# EAGLE design cc2652rb_v3.1 (EAGLE 9.6.2)
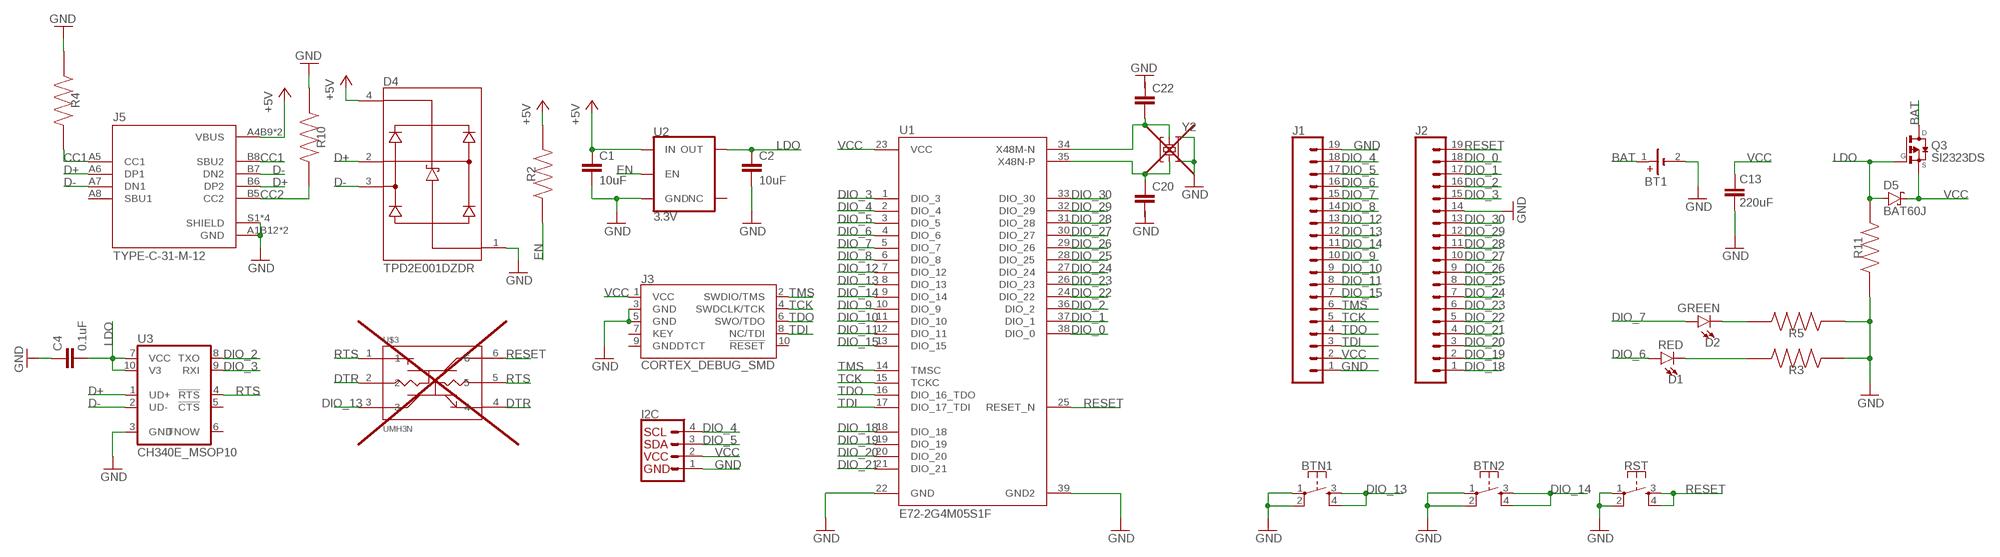
[diagram p0: schematic, sheet 1]

## Parts
BT1  79527141  [79527141]
BTN1  MOMENTARY-SWITCH-SPST-2-SMD-4.6X2.8MM  [TACTILE_SWITCH_SMD_4.6X2.8MM]
BTN2  MOMENTARY-SWITCH-SPST-2-SMD-4.6X2.8MM  [TACTILE_SWITCH_SMD_4.6X2.8MM]
C1  10uF  10UF-0603-6.3V-20%  [0603]
C2  10uF  10UF-0603-6.3V-20%  [0603]
C4  0.1uF  0.1UF-0603-25V-(+80/-20%)  [0603]
C13  220uF  C_TANTALUM-2917(7343-METRIC)  [CAPM7343X310]
C20  7p  CAP0402  [CAPC1005X40N]
C22  7p  CAP0402  [CAPC1005X40N]
D1  RED  LED-RED0603  [LED-0603]
D2  GREEN  LED-GREEN0603  [LED-0603]
D4  TPD2E001DZDR  [SOT192P237X122-4N]
D5  BAT60J  [SOD323_ST]
I2C  QWIIC_CONNECTORJS-1MM  [1X04_1MM_RA]
J1  CONN_191X19_NO_SILK  [1X19_NO_SILK]
J2  CONN_191X19_NO_SILK  [1X19_NO_SILK]
J3  CORTEX_DEBUG_SMD  [SAMTECH_FTSH-105-01]
J5  TYPE-C-31-M-12  [HRO_TYPE-C-31-M-12]
Q3  SI2323DS  [SOT23]
R2  10k  RC0402FR-073M6L  [RESC1005X40N]
R3  2k  RC0402FR-073M6L  [RESC1005X40N]
R4  5.1k  RC0402FR-073M6L  [RESC1005X40N]
R5  2k  RC0402FR-073M6L  [RESC1005X40N]
R10  5.1k  RC0402FR-073M6L  [RESC1005X40N]
R11  100k  RC0402FR-073M6L  [RESC1005X40N]
RST  MOMENTARY-SWITCH-SPST-2-SMD-4.6X2.8MM  [TACTILE_SWITCH_SMD_4.6X2.8MM]
U1  E72-2G4M05S1F  [E72-2G4M05S1F]
U2  3.3V  V_REG_AP2112K-3.3V  [SOT23-5]
U3  CH340E_MSOP10  [MSOP10]
U$3  UMH3N  [SOP65P210X100-6N]
Y2  Q22FA12800150  48.000MHZ_CX2016DB48000C0FPLC1  [XTAL-4P-2016]

## Nets
+5V: C1.1 D4.4(VCC) J5.A4B9(VBUS) J5.B4A9(VBUS) R2.2 U2.1(IN)
BAT: BT1.1(+) Q3.3(D)
CC1: J5.A5(CC1) J5.B8(SBU2) R4.2
CC2: J5.B5(CC2) R10.2
D+: D4.2(IO1) J5.A6(DP1) J5.B6(DP2) U3.1(UD+)
D-: D4.3(IO2) J5.A7(DN1) J5.B7(DN2) U3.2(UD-)
DIO_0: J2.18 U1.38(DIO_0)
DIO_1: J2.17 U1.37(DIO_1)
DIO_2: J2.16 U1.36(DIO_2) U3.8(TXO)
DIO_3: J2.15 U1.1(DIO_3) U3.9(RXI)
DIO_4: I2C.4(SCL) J1.18 U1.2(DIO_4)
DIO_5: I2C.3(SDA) J1.17 U1.3(DIO_5)
DIO_6: D1.A J1.16 U1.4(DIO_6)
DIO_7: D2.A J1.15 U1.5(DIO_7)
DIO_8: J1.14 U1.6(DIO_8)
DIO_9: J1.10 U1.10(DIO_9)
DIO_10: J1.9 U1.11(DIO_10)
DIO_11: J1.8 U1.12(DIO_11)
DIO_12: J1.13 U1.7(DIO_12)
DIO_13: BTN1.3 BTN1.4 J1.12 U1.8(DIO_13) U$3.3
DIO_14: BTN2.3 BTN2.4 J1.11 U1.9(DIO_14)
DIO_15: J1.7 U1.13(DIO_15)
DIO_18: J2.1 U1.18(DIO_18)
DIO_19: J2.2 U1.19(DIO_19)
DIO_20: J2.3 U1.20(DIO_20)
DIO_21: J2.4 U1.21(DIO_21)
DIO_22: J2.5 U1.24(DIO_22)
DIO_23: J2.6 U1.26(DIO_23)
DIO_24: J2.7 U1.27(DIO_24)
DIO_25: J2.8 U1.28(DIO_25)
DIO_26: J2.9 U1.29(DIO_26)
DIO_27: J2.10 U1.30(DIO_27)
DIO_28: J2.11 U1.31(DIO_28)
DIO_29: J2.12 U1.32(DIO_29)
DIO_30: J2.13 U1.33(DIO_30)
DTR: U$3.2 U$3.4
EN: R2.1 U2.3(EN)
GND: BT1.2(-) BTN1.1 BTN1.2 BTN2.1 BTN2.2 C1.2 C2.2 C4.1 C13.2 D4.1(GND) I2C.1(GND) J1.1 J1.19 J2.14 J3.3(GND) J3.5(GND) J5.A1B12(GND) J5.B1A12(GND) J5.S1(SHIELD) J5.S2(SHIELD) J5.S3(SHIELD) J5.S4(SHIELD) R3.1 R4.1 R5.1 R10.1 R11.1 RST.1 RST.2 U1.22(GND) U1.39(GND2) U2.2(GND) U3.3(GND) Y2.2 Y2.4
LDO: C2.1 C4.2 D5.A Q3.1(G) R11.2 U2.5(OUT) U3.7(VCC) U3.10(V3)
N$1: C20.1 U1.35(X48N-P) Y2.1
N$2: D1.C R3.2
N$3: D2.C R5.2
N$4: C22.2 U1.34(X48M-N) Y2.3
RESET: J2.19 RST.3 RST.4 U1.25(RESET_N) U$3.6
RTS: U3.4(!RTS) U$3.1 U$3.5
TCK: J1.5 J3.4(SWDCLK/TCK) U1.15(TCKC)
TDI: J1.3 J3.8(NC/TDI) U1.17(DIO_17_TDI)
TDO: J1.4 J3.6(SWO/TDO) U1.16(DIO_16_TDO)
TMS: J1.6 J3.2(SWDIO/TMS) U1.14(TMSC)
VCC: C13.1 D5.C I2C.2(VCC) J1.2 J3.1(VCC) Q3.2(S) U1.23(VCC)
Unconnected: C20.2 C22.1 J3.7(KEY) J3.9(GNDDTCT) J3.10(!RESET) J5.A8(SBU1) U2.4(NC) U3.5(!CTS) U3.6(TNOW)

## Library data of the parts
BT1 = Battery Holder_2:79527141: BATTERY HOLDER COIN 20MM SMD Manufacturer's datasheet <https://katalog.we-online.de/em/datasheet/79527141.pdf>; CREATED_BY: PCBLayout.com; DIGIKEY_PART_NO: 732-12325-2-ND; MANUFACTURER: Wurth Electronics Inc.; MPN: 79527141
BTN1 BTN2 RST = SparkFun-Switches:MOMENTARY-SWITCH-SPST-2: Momentary Switch (Pushbutton) - SPST - Two Circuits Normally-open (NO) SPST momentary switches (buttons, pushbuttons). Schematic symbol includes two switch circuits. Variants SMD-4.6MMX2.8MM - 4.60mm x 2.80mm Tactile Momentary Button Switch - Used on SparkFun SAMD21 Mini Breakout <https://www.sparkfun.com/products/13664> SMD-5.2MM - Mini Pushbutton Switch - SMD <https://www.sparkfun.com/products/8720> - Used on Arduino Pro Mini <https://www.sparkfun.com/products/11114>; PROD_ID: SWCH-13065
C1 C2 = SparkFun-Capacitors:10UF: 10.0µF ceramic capacitors A capacitor is a passive two-terminal electrical component used to store electrical energy temporarily in an electric field.; PROD_ID: CAP-11015
C4 = SparkFun-Capacitors:0.1UF: 0.1µF ceramic capacitors A capacitor is a passive two-terminal electrical component used to store electrical energy temporarily in an electric field.; PROD_ID: CAP-00810
C13 = Capacitor:C: Capacitor - Generic; CATEGORY: Capacitor
C20 C22 = discretes-dev:CAP0402: CAP, 0402; AVAILABILITY: Good; DESCRIPTION: RESISTOR, 0402 0.063W 1% 3M6; Resistance:3.6Mohm; Resistance Tolerance:± 1%; Power Rating:0.063W; Voltage Rating:50V; Series:RC32H; Temperature Coefficient:± 100ppm/°C; Resistor Element Type:Thick Film; Resistor Case Style:0402; No. of Pins:2; SVHC:No SVHC; Case Style:0402; External Length / Height:1mm; Temperature Coeff. +:100ppm/°C; Temperature Coeff. -:100ppm/°C; External Depth:0.35mm; External Width:0.5mm; Operating Temperature Range:-55°C to +155°C; Overload Voltage:100V; MF: Yageo; MP: RC0402FR-073M6L; PACKAGE: 1005 Panasonic Electronic Components; PRICE: None; PURCHASE-URL: https://pricing.snapeda.com/search/part/RC0402FR-073M6L/?ref=eda
D1 = SparkFun-LED:LED-RED: Red SMD LED Used in manufacturing of most products at SparkFun Packages: 0603 - SMD 0603 package [Product Link] <http://docs.avagotech.com/docs/AV02-0551EN> 0603 SMART - SMD 0603 SMART package ( more efficient and expensive)[Product Link] <http://www.osram-os.com/Graphics/XPic2/00077099_0.pdf> 1206 - SMD1206 package [Product Link] <https://www.sparkfun.com/datasheets/DevTools/LilyPad/Q150OVS4.pdff> SparkFun Products: Pro Mini 328 -5V <https://www.sparkfun.com/products/821> RedBoard <https://www.sparkfun.com/products/12757> IOIO-OTG <https://www.sparkfun.com/products/13613>; PROD_ID: DIO-00819
D2 = SparkFun-LED:LED-GREEN: Green SMD LED Used in manufacturing of various products at SparkFun Packages: 0603 - SMD 0603 package [Product Link] <http://www.futureelectronics.com/en/technologies/semiconductors/optoelectronics/leds/Pages/9894312-LTST-C190GKT.aspx?CrossPart=HSMG-C190&IM=0> LilyPad 1206 - SMD1206 LilyPad package [Product Link] <http://www.futureelectronics.com/en/Technologies/Product.aspx?ProductID=IN150NGHARVATEKCORPORATION2049943&IM=0> 1206 - SMD1206 package [Product Link] <http://www.futureelectronics.com/en/technologies/semiconductors/optoelectronics/leds/Pages/8315665-LTST-C150KGKT.aspx?IM=0> 1206 Bottom Mount -SMD 1206 Bottom Mount [Product Link] <http://www.digikey.com/product-detail/en/lite-on-inc/LTST-C230KGKT/160-1456-1-ND/386854> SparkFun Products: Pro Mini 328 -5V <https://www.sparkfun.com/products/821> RedBoard <https://www.sparkfun.com/products/12757> MP3 Trigger <https://www.sparkfun.com/products/13720> Makey Makey <https://www.sparkfun.com/products/11076>; PROD_ID: DIO-00821
D4 = TPD2E001DZDR:TPD2E001DZDR: Low-capacitance 2-channel +/-15k-V ESD protection array for high-speed data interfaces Check prices <https://pricing.snapeda.com/parts/TPD2E001DZDR/Texas%20Instruments/view-part?ref=eda>; AVAILABILITY: In Stock; DESCRIPTION: Low-capacitance 2-channel +/-15k-V ESD protection array for high-speed data interfaces 4-SOT-23 -40 to 85; MF: Texas Instruments; MP: TPD2E001DZDR; PACKAGE: SOT-23-4 Texas Instruments; PRICE: None; PURCHASE-URL: https://pricing.snapeda.com/search/part/TPD2E001DZDR/?ref=eda
D5 = diode:BAT60J: Schottky barrier diode Source: www.st.com, BAT60J.pdf
I2C = SparkFun-Connectors:QWIIC_CONNECTOR: SparkFun I2C Standard Qwiic Connector An SMD 1mm pitch JST connector makes it easy and quick (get it? Qwiic?) to connect I2C devices to each other. The Qwiic system <http://www.sparkfun.com/qwiic> enables fast and solderless connection between popular platforms and various sensors and actuators. We carry 200mm <https://www.sparkfun.com/products/14204>, 100mm <https://www.sparkfun.com/products/14205>, 50mm <https://www.sparkfun.com/products/14206>, and breadboard friendly <https://www.sparkfun.com/products/14207> Qwiic cables. We also offer 10 pcs strips <https://www.sparkfun.com/products/14323> the SMD connectors.
J1 J2 = SparkFun-Connectors:CONN_19: Multi connection point. Often used as Generic Header-pin footprint for 0.1 inch spaced/style header connections On any of the 0.1 inch spaced packages, you can populate with these: Break Away Headers - Straight <https://www.sparkfun.com/products/116> (PRT-00116) Break Away Male Headers - Right Angle <https://www.sparkfun.com/products/553> (PRT-00553) Female Headers <https://www.sparkfun.com/products/115> (PRT-00115) Break Away Headers - Machine Pin <https://www.sparkfun.com/products/117> (PRT-00117) Break Away Female Headers - Swiss Machine Pin <https://www.sparkfun.com/products/743> (PRT-00743) For SCREWTERMINALS and SPRING TERMINALS visit here: Screw Terimnals on SparkFun.com <https://www.sparkfun.com/search/results?term=Screw+Terminals> (5mm/3.5mm/2.54mm spacing) This device is also useful as a general connection point to wire up your design to another part of your project. Our various solder wires solder well into these plated through hole pads. Hook-Up Wire - Assortment (Stranded, 22 AWG) <https://www.sparkfun.com/products/11375> (PRT-11375) Hook-Up Wire - Assortment (Solid Core, 22 AWG) <https://www.sparkfun.com/products/11367> (PRT-11367) View the entire wire category on our website here <https://www.sparkfun.com/categories/141> Special notes: Molex polarized connector foot print use with SKU : PRT-08231 with associated crimp pins and housings. 1MM SMD Version SKU: PRT-10208 NOTES ON THE VARIANTS LOCK and LOCK_LONGPADS... This footprint was designed to help hold the alignment of a through-hole component (i.e. 6-pin header) while soldering it into place. You may notice that each hole has been shifted either up or down by 0.005 of an inch from it's more standard position (which is a perfectly straight line). This slight alteration caused the pins (the squares in the middle) to touch the edges of the holes. Because they are alternating, it causes a "brace" to hold the component in place. 0.005 has proven to be the perfect amount of "off-center" position when using our standard breakaway headers. Although looks a little odd when you look at the bare footprint, once you have a header in there, the alteration is very hard to notice. Also,if you push a header all the way into place, it is covered up entirely on the bottom side.
J3 = SparkFun-Connectors:CORTEX_DEBUG: Cortex Debug Connector - 10 pin Supports JTAG debug, Serial Wire debug, and Serial Wire Viewer. PTH and SMD connector options available. General Connector Information <http://infocenter.arm.com/help/topic/com.arm.doc.faqs/attached/13634/cortex_debug_connectors.pdf> Products: PTH Connector <http://www.digikey.com/product-detail/en/cnc-tech/3220-10-0100-00/1175-1627-ND/3883661> -via Digi-Key SparkFun PSoc <https://www.sparkfun.com/products/13229> SparkFun T <https://www.sparkfun.com/products/13810>
J5 = TYPE-C-31-M-12:TYPE-C-31-M-12: USB Connectors 24 Receptacle 1 8.94*7.3mm RoHS; AVAILABILITY: Unavailable; DESCRIPTION: USB Connectors 24 Receptacle 1 8.94*7.3mm RoHS; MF: HRO Electronics Co., Ltd.; MP: TYPE-C-31-M-12; PACKAGE: Package; PRICE: None
Q3 = SI2323DS:SI2323DS: P-Channel MOSFET; AVAILABILITY: Unavailable; DESCRIPTION: P-Channel 20V 3.7A (Ta) 750mW (Ta) Surface Mount SOT-23-3 (TO-236); MF: Vishay Siliconix; MP: SI2323DS; PACKAGE: SOT-23-3 Vishay Siliconix; PRICE: None
R2-R5 R10 R11 = RC0402FR-073M6L:RC0402FR-073M6L: RESISTOR, 0402 0.063W 1% 3M6; Resistance:3.6Mohm; Resistance Tolerance:± 1%; Power Rating:0.063W; Voltage Rating:50V; Series:RC32H; Temperature Coefficient:± 100ppm/°C; Resistor Element Type:Thick Film; Resistor Case Style:0402; No. of Pins:2; SVHC:No SVHC; Case Style:0402; External Length / Height:1mm; Temperature Coeff. +:100ppm/°C; Temperature Coeff. -:100ppm/°C; External Depth:0.35mm; External Width:0.5mm; Operating Temperature Range:-55°C to +155°C; Overload Voltage:100V Check prices <https://pricing.snapeda.com/parts/RC0402FR-073M6L/Yageo/view-part?ref=eda>; AVAILABILITY: Good; DESCRIPTION: RESISTOR, 0402 0.063W 1% 3M6; Resistance:3.6Mohm; Resistance Tolerance:± 1%; Power Rating:0.063W; Voltage Rating:50V; Series:RC32H; Temperature Coefficient:± 100ppm/°C; Resistor Element Type:Thick Film; Resistor Case Style:0402; No. of Pins:2; SVHC:No SVHC; Case Style:0402; External Length / Height:1mm; Temperature Coeff. +:100ppm/°C; Temperature Coeff. -:100ppm/°C; External Depth:0.35mm; External Width:0.5mm; Operating Temperature Range:-55°C to +155°C; Overload Voltage:100V; MF: Yageo; MP: RC0402FR-073M6L; PACKAGE: 1005 Panasonic Electronic Components; PRICE: None; PURCHASE-URL: https://pricing.snapeda.com/search/part/RC0402FR-073M6L/?ref=eda
U1 = E72-2G4M05S1F:E72-2G4M05S1F
U2 = SparkFun-IC-Power:V_REG_AP2112: AP2112 - 600mA CMOS LDO Regulator w/ Enable The AP2112 is CMOS process low dropout linear regulator with enable function, the regulator delivers a guaranteed 600mA (min.) continuous load current. Features Output Voltage Accuracy: ±1.5% Output Current: 600mA (Min.) Foldback Short Current Protection: 50mA Enable Function to Turn ON/OFF VOUT Low Dropout Voltage (3.3V): 250mV (Typ.) @IOUT=600mA Excellent Load Regulation: 0.2%/A (Typ.) Excellent Line Regulation: 0.02%/V (Typ.) Low Quiescent Current: 55μA (Typ.) Low Standby Current: 0.01μA (Typ.) Low Output Noise: 50μVRMS PSRR: 100Hz -65dB, 1kHz -65dB OTSD Protection Stable with 1.0μF Flexible Cap: Ceramic, Tantalum and Aluminum Electrolytic Operation Temperature Range: -40°C to 85°C ESD: MM 400V, HBM 4000V; PROD_ID: VREG-12457
U3 = CH340E:CH340E: Check prices <https://pricing.snapeda.com/parts/CH340E/WCH/view-part?ref=eda>; AVAILABILITY: Not in stock; DESCRIPTION: USB to serial chip CH340; MF: WCH; MP: CH340E; PACKAGE: Package; PRICE: None
U$3 = UMH3N:UMH3N: Dual PNP/NPN transistor for chip reset; AVAILABILITY: Unavailable; DESCRIPTION: Pre-Biased Bipolar Transistor (BJT) 2 NPN - Pre-Biased (Dual) 50V 100mA 250MHz 150mW Surface Mount UMT6; MF: Rohm; MP: UMH3N; PACKAGE: SOT-363 Rohm; PRICE: None
Y2 = ok-xtal-osc-dev:48.000MHZ_CX2016DB48000C0FPLC1: 48MHz ±10ppm Crystal 7pF 50 Ohms 4-SMD, No Lead Datasheet <https://media.digikey.com/pdf/Data%20Sheets/Kyocera%20International/CX2016DB48000C0FPLC1_DS.pdf>; DIGIKEY_PART: 1253-2042-1-ND; MFG_NAME: KYOCERA; MFG_PART: CX2016DB48000C0FPLC1

## Net classes
0 default: clearance 0.205 mm

## Board
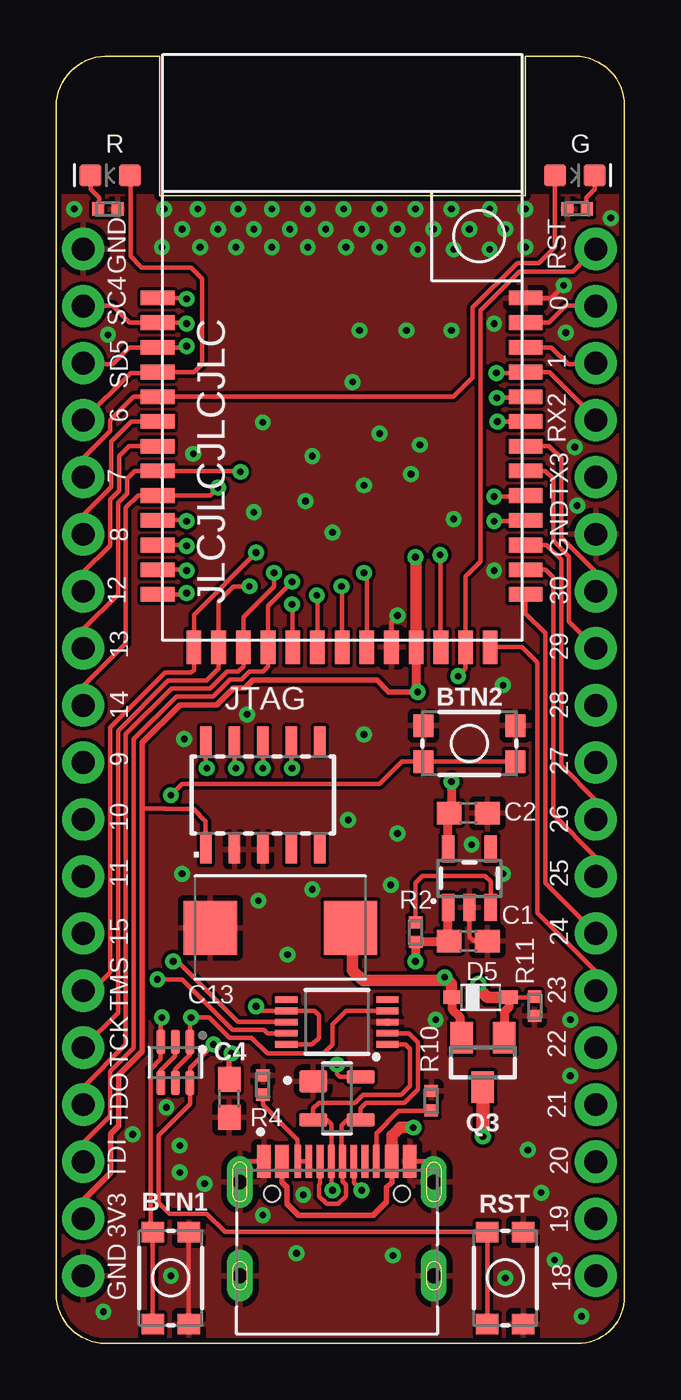
[diagram p1: board, top side]
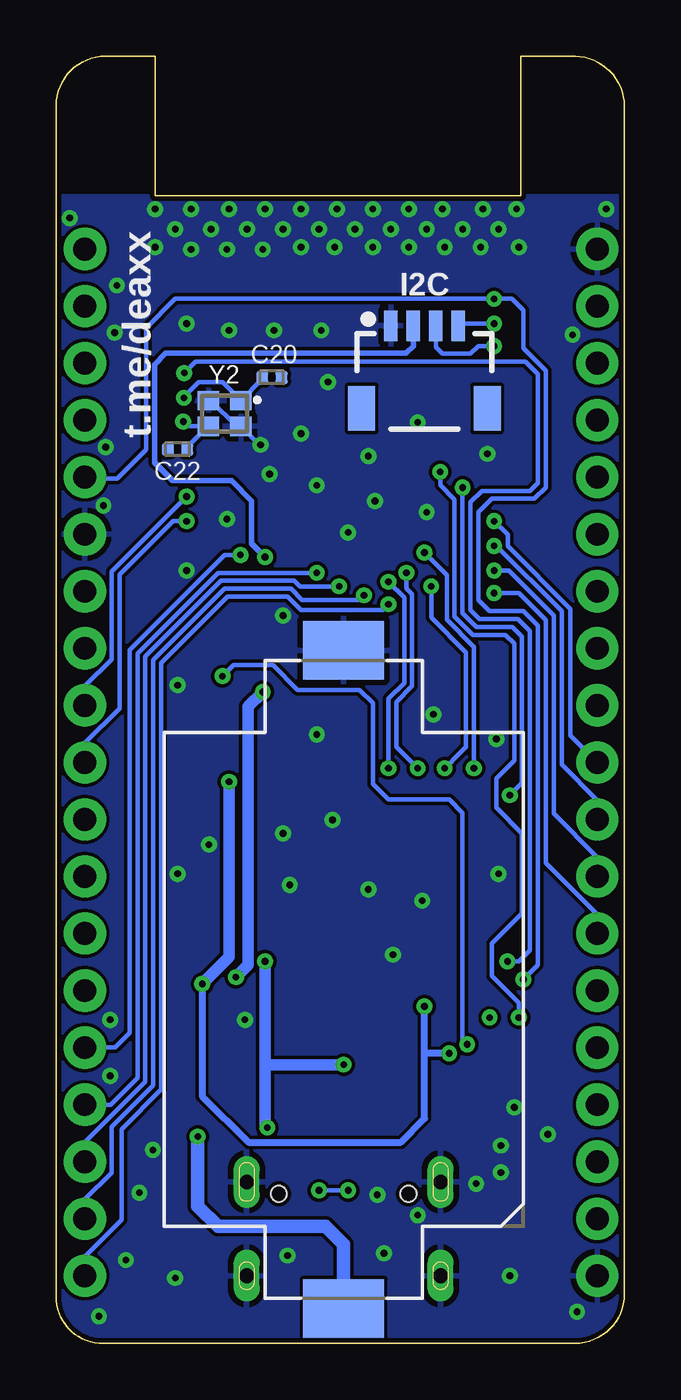
[diagram p2: board, bottom side, seen from below]

Size 25.32 x 57.32 mm. Coordinates in mm from the lower left corner, seen from the top.
Outline: 2.31,0.01 2.41,0.01
Outline: 2.41,0.01 23.21,0.01 arc87 25.31,1.91 25.31,54.91
Outline: 2.31,57.31 2.41,57.31
Outline: 2.41,57.31 arc87 0.01,55.31 0.01,2.41 arc100 2.41,0.01
Outline: 2.41,57.31 4.61,57.31 4.61,51.11 20.91,51.11 20.91,57.31 22.91,57.31
Outline: 22.91,57.31 23.01,57.31
Outline: 25.31,55.01 25.31,54.91
Outline: 22.91,57.31 arc-100 25.31,54.91
Copper layers (1*16): Top 0.035mm / dielectric 1.5mm / Bottom 0.035mm
Design rules "default *": minimum track width 0.2mm, minimum drill 0.3mm, track to track 6mil, track to pad 6mil, pad to pad 6mil, via to via 6mil, smd to smd 6mil, copper to edge 0.2mm, drill to drill 0.3mm, minimum pad ring 10mil, minimum via ring 8mil, stop-mask expansion 2.5mil, vias tented up to drill 0.3mm, thermal gap 10mil

### Footprints (pad centres in the part's own frame; a part is rotated, then mirrored left to right if it is on the bottom)
79527141 = smd 2.6 x 3.6: 1 -14.65,0; 2 14.65,0
TACTILE_SWITCH_SMD_4.6X2.8MM = smd 0.9 x 1: 1 -2.05,-0.8; 2 2.05,-0.8; 3 2.05,0.8; 4 -2.05,0.8
0603 = smd 1.1 x 1: 1 -0.85,0; 2 0.85,0
CAPM7343X310 = smd 2.368 x 2.404: 1 -3.121,0; 2 3.121,0
CAPC1005X40N = smd 0.54 x 0.6: 1 -0.432,0; 2 0.432,0
LED-0603 = smd 1 x 1: A -0.877,0; C 0.877,0
SOT192P237X122-4N = smd 1.24 x 0.99: 1 -1.055,0.76 | smd 1.24 x 0.59: 2 -1.055,-0.96; 3 1.055,-0.96; 4 1.055,0.96
SOD323_ST = smd 0.8 x 0.6: A 1.25,0; C -1.25,0
1X04_1MM_RA = smd 0.6 x 1.35: 1 -1.5,0; 2 -0.5,0; 3 0.5,0; 4 1.5,0 | smd 1.2 x 2: NC1 2.8,-3.675; NC2 -2.8,-3.675
1X19_NO_SILK = drill 1.016 pad 1.88: 1 0,0; 2 2.54,0; 3 5.08,0; 4 7.62,0; 5 10.16,0; 6 12.7,0; 7 15.24,0; 8 17.78,0; 9 20.32,0; 10 22.86,0; 11 25.4,0; 12 27.94,0; 13 30.48,0; 14 33.02,0; 15 35.56,0; 16 38.1,0; 17 40.64,0; 18 43.18,0; 19 45.72,0
SAMTECH_FTSH-105-01 = smd 0.508 x 1.27: 1 -2.54,-2.413; 2 -2.54,2.413; 3 -1.27,-2.413; 4 -1.27,2.413; 5 0,-2.413; 6 0,2.413; 7 1.27,-2.413; 8 1.27,2.413; 9 2.54,-2.413; 10 2.54,2.413
HRO_TYPE-C-31-M-12 = smd 0.6 x 1.45: A1B12 -3.25,5.095; A4B9 -2.45,5.095; B1A12 3.25,5.095; B4A9 2.45,5.095 | smd 0.3 x 1.45: A5 -1.25,5.095; A6 -0.25,5.095; A7 0.25,5.095; A8 1.25,5.095; B5 1.75,5.095; B6 0.75,5.095; B7 -0.75,5.095; B8 -1.75,5.095 | drill 0.65 pad 1.05 long: S1 -4.32,4.18; S2 4.32,4.18; S3 -4.32,0; S4 4.32,0 | hole 0.7: -2.89,3.65; 2.89,3.65
SOT23 = smd 1 x 1.4: 1 -0.95,-1.1; 2 0.95,-1.1; 3 0,1.1
RESC1005X40N = smd 0.54 x 0.6: 1 -0.432,0; 2 0.432,0
E72-2G4M05S1F = smd 1.5 x 0.65: 1 -8.43,3.15; 2 -8.43,2.05; 3 -8.43,0.95; 4 -8.43,-0.15; 5 -8.43,-1.25; 6 -8.43,-2.35; 7 -8.43,-3.45; 8 -8.43,-4.55; 9 -8.43,-5.65; 10 -8.43,-6.75; 11 -8.43,-7.85; 12 -8.43,-8.95; 13 -8.43,-10.05; 27 7.96,-10.05; 28 7.96,-8.95; 29 7.96,-7.85; 30 7.96,-6.75; 31 7.96,-5.65; 32 7.96,-4.55; 33 7.96,-3.45; 34 7.96,-2.35; 35 7.96,-1.25; 36 7.96,-0.15; 37 7.96,0.95; 38 7.96,2.05; 39 7.96,3.15 | smd 0.65 x 1.5: 14 -6.81,-12.4; 15 -5.71,-12.4; 16 -4.61,-12.4; 17 -3.51,-12.4; 18 -2.41,-12.4; 19 -1.31,-12.4; 20 -0.21,-12.4; 21 0.89,-12.4; 22 1.99,-12.4; 23 3.09,-12.4; 24 4.19,-12.4; 25 5.29,-12.4; 26 6.39,-12.4
SOT23-5 = smd 0.55 x 1.2: 1 -0.95,-1.3; 2 0,-1.3; 3 0.95,-1.3; 4 0.95,1.3; 5 -0.95,1.3
MSOP10 = smd 1 x 0.3: 1 -2.25,1; 2 -2.25,0.5; 3 -2.25,0; 4 -2.25,-0.5; 5 -2.25,-1; 6 2.25,-1; 7 2.25,-0.5; 8 2.25,0; 9 2.25,0.5; 10 2.25,1
SOP65P210X100-6N = smd 1.09 x 0.4: 1 -0.92,0.65; 2 -0.92,0; 3 -0.92,-0.65; 4 0.92,-0.65; 5 0.92,0; 6 0.92,0.65
XTAL-4P-2016 = smd 0.95 x 0.85: 1 -0.725,-0.575; 2 0.725,-0.575; 3 0.725,0.575; 4 -0.725,0.575

### Placement (x,y rotation side)
BT1  12.51,16.21 90 bottom
BTN1  5.11,2.91 90 top
BTN2  18.41,26.71 180 top
C1  18.36,17.91 0 top
C2  18.36,23.61 0 top
C4  7.71,10.91 90 top
C13  9.99,18.51 180 top
C20  15.71,43.01 0 bottom
C22  19.91,39.81 0 bottom
D1  2.41,52.01 180 top
D2  23.11,52.01 0 top
D4  12.51,10.91 0 top
D5  18.91,15.41 0 top
I2C  8.91,45.31 0 bottom
J1  1.21,3.01 90 top
J2  24.04,3.01 90 top
J3  9.21,24.41 0 top
J5  12.51,3.01 0 top
Q3  19.01,12.51 180 top
R2  16.01,18.31 270 top
R3  2.31,50.51 180 top
R4  9.21,11.51 270 top
R5  23.21,50.51 0 top
R10  16.71,10.81 270 top
R11  21.31,15.01 90 top
RST  20.01,2.91 90 top
U1  12.95,43.4 0 top
U2  18.41,20.71 0 top
U3  12.51,14.31 180 top
U$3  5.31,12.51 270 top
Y2  17.81,41.41 180 bottom

### Tracks (layer width: path | path; a pad name or v marks a point on that pad's centre or on a via)
+5V  (via drill 0.3)
  Top 0.2: D4.4 12.65,11.87 12.51,12.01 v12.51,12.41
  Top 0.254: J5.A4B9 10.06,7.18 10.3,6.94 10.3,6.22 10.81,5.71 14.12,5.71 14.72,6.31 14.72,6.94 14.96,7.18 J5.B4A9
  Top 0.406: U2.1 17.46,17.96 C1.1 17.48,17.88 R2.2 v16.01,17.01
  Top 0.508: J5.B4A9 14.96,9.25 15.11,9.4 15.12,9.4 15.33,9.61 v15.91,9.61
  Bottom 0.508: v16.01,17.01 16.01,12.41 | 16.01,12.41 16.01,9.71 v15.91,9.61 | v12.51,12.41 16.01,12.41
BAT  (via drill 0.3)
  Top 0.61: Q3.3 v19.01,9.21
  Bottom 0.61: BT1.1 12.51,4.41 13.31,5.21 18.11,5.21 19.01,6.11 v19.01,9.21
CC1
  Top 0.2: J5.A5 J5.B8 10.76,9.06 9.21,10.61 R4.2
CC2
  Top 0.2: J5.B5 14.26,9.36 15.26,10.36 16.69,10.36 R10.2
D+  (via drill 0.3)
  Top 0.2: v12.31,6.81 12.26,6.86 J5.A6 12.26,9.76 12.07,9.95 D4.2 11.45,10.45 11.71,10.71 13.31,10.71 13.66,11.06 15.36,11.06 15.76,11.46 15.76,13.11 15.56,13.31 U3.1 | J5.B6 13.27,7.15 v13.61,6.81
  Bottom 0.2: v12.31,6.81 v13.61,6.81
D-
  Top 0.2: U3.2 15.71,13.81 16.11,13.41 16.11,11.31 15.51,10.71 13.81,10.71 13.56,10.46 D4.3 12.95,9.95 12.71,9.71 12.71,8.15 J5.A7 12.76,7.22 12.92,7.06 12.92,6.56 12.56,6.2 12.06,6.2 11.7,6.56 11.7,7.06 11.76,7.12 J5.B7
DIO_0
  Top 0.2: U1.38 21.95,45.45 22.71,46.21 24.02,46.21 J2.18
DIO_1
  Top 0.2: U1.37 22.07,44.35 22.81,43.61 24,43.61 J2.17
DIO_2  (via drill 0.3)
  Top 0.2: J2.16 24.04,41.18 21.97,43.25 U1.36 20.87,43.21 v19.61,43.21 | U3.8 8.11,14.31 5.41,17.01 v5.21,17.01
  Bottom 0.2: v19.61,43.21 19.11,43.71 4.41,43.71 3.86,43.16 3.86,38.31 4.21,37.96 6.36,37.96 6.86,37.46 6.86,32.66 6.46,32.26 4.75,32.26 4.21,31.72 4.21,17.51 4.71,17.01 v5.21,17.01
DIO_3  (via drill 0.3)
  Top 0.2: v4.51,16.21 5.61,16.21 7.86,13.96 9.26,13.96 9.41,13.81 U3.9 | U1.1 5.77,46.55 v5.81,46.51
  Bottom 0.2: v4.51,16.21 3.86,16.86 3.86,31.96 4.5,32.61 6.01,32.61 6.51,33.11 6.51,37.01 5.91,37.61 4.01,37.61 3.51,38.11 3.51,43.31 4.51,44.31 4.51,46.01 5.01,46.51 v5.81,46.51 20.01,46.51 21.31,45.21 21.31,39.81 22.61,38.51 23.98,38.51 J2.15
DIO_4  (via drill 0.3)
  Top 0.2: J1.18 1.23,46.21 2.51,46.21 3.27,45.45 U1.2 5.77,45.45 v5.81,45.41
  Bottom 0.2: v5.81,45.41 7.31,45.41 I2C.4
DIO_5  (via drill 0.3)
  Top 0.2: J1.17 1.25,43.61 2.51,43.61 3.25,44.35 U1.3 5.75,44.35 v5.81,44.41
  Bottom 0.2: v5.81,44.41 6.51,44.41 6.86,44.06 8.11,44.06 8.41,44.36 I2C.3
DIO_6
  Top 0.2: J1.16 3.31,43.21 4.48,43.21 U1.4 6.15,43.25 6.51,43.61 6.51,47.41 6.01,47.91 3.81,47.91 3.31,48.41 3.31,51.99 D1.A
DIO_7
  Top 0.2: J1.15 1.21,39.42 2.4,40.62 2.4,41.1 3.45,42.15 U1.5 17.69,42.15 18.55,43.01 18.55,46.12 20.54,48.11 21.51,48.11 22.21,48.81 22.21,51.99 D2.A
DIO_8
  Top 0.2: J1.14 1.21,36.88 2.45,38.13 2.45,40.15 3.35,41.05 U1.6
DIO_9  (via drill 0.3)
  Top 0.2: U1.10 5.77,36.65 v5.81,36.61
  Bottom 0.2: J1.10 2.4,27.06 2.4,32.71 5.2,35.51 5.2,36 v5.81,36.61
DIO_10  (via drill 0.3)
  Top 0.2: U1.11 5.77,35.55 v5.81,35.51
  Bottom 0.2: v5.81,35.51 5.7,35.51 2.8,32.61 2.8,25.78 1.21,24.18 J1.9
DIO_11  (via drill 0.3)
  Top 0.2: U1.12 5.77,34.45 v5.81,34.41
  Bottom 0.2: v5.81,34.41 5.15,34.41 3.15,32.41 3.15,23.59 1.21,21.64 J1.8
DIO_12
  Top 0.2: J1.13 1.21,34.34 2.4,35.54 2.4,37.58 2.81,37.98 2.81,39.51 3.25,39.95 U1.7
DIO_13  (via drill 0.3)
  Top 0.2: J1.12 1.21,31.8 2.75,33.35 2.75,37.43 3.16,37.84 3.16,38.51 3.5,38.85 U1.8 8.17,38.85 v8.21,38.81 | v4.71,14.51 4.66,14.46 U$3.3 4.66,12.66 4.21,12.21 4.21,11 4.21,5.06 BTN1.3 BTN1.4
  Bottom 0.2: v8.21,38.81 8.21,38.21 7.57,37.57 7.57,32.37 6.75,31.55 5.31,31.55 4.92,31.16 4.92,25.96 5.72,25.16 5.72,23.86 4.56,22.71 4.56,19.16 5.92,17.8 5.92,16.36 4.71,15.15 v4.71,14.51
DIO_14  (via drill 0.3)
  Top 0.2: J1.11 1.21,29.26 3.11,31.16 3.11,37.21 3.65,37.75 U1.9 6.85,37.75 v7.21,38.11 | v5.11,24.41 5.61,24.91 14.41,24.91 15.41,25.91 BTN2.3 BTN2.4
  Bottom 0.2: v7.21,38.11 v7.21,38.1 7.21,32.52 6.6,31.9 5,31.9 4.56,31.47 4.56,24.96 v5.11,24.41
DIO_15  (via drill 0.3)
  Top 0.2: U1.13 5.75,33.35 v5.81,33.41
  Bottom 0.2: v5.81,33.41 4.71,33.41 3.51,32.21 3.51,21.4 1.21,19.1 J1.7
DIO_18  (via drill 0.3)
  Top 0.2: U1.18 10.54,32.88 v10.51,32.91
  Bottom 0.2: J2.1 24.04,3.86 22.41,5.49 22.41,9.54 20.64,11.31 20.64,30.29 17.67,33.25 15.01,33.25 14.4,32.65 10.77,32.65 v10.51,32.91
DIO_19  (via drill 0.3)
  Top 0.2: U1.19 11.64,33.28 v11.61,33.31
  Bottom 0.2: v11.61,33.31 11.61,33.11 11.62,33.1 14.36,33.1 14.86,33.6 17.82,33.6 20.99,30.43 20.99,11.49 22.85,9.64 22.85,7.6 24.04,6.4 J2.2
DIO_20  (via drill 0.3)
  Top 0.2: U1.20 12.74,33.71 v12.71,33.71
  Bottom 0.2: v12.71,33.71 v12.72,33.7 14.46,33.7 14.71,33.96 17.97,33.96 21.34,30.58 21.34,11.64 24.04,8.94 J2.3
DIO_21  (via drill 0.3)
  Top 0.2: U1.21 13.84,34.18 v13.71,34.31
  Bottom 0.2: v13.71,34.31 18.11,34.31 21.69,30.73 21.69,11.83 22.89,10.63 J2.4
DIO_22  (via drill 0.3)
  Top 0.2: U1.24 17.11,31.03 v17.11,35.11
  Bottom 0.2: v17.11,35.11 17.81,35.11 22.05,30.87 22.05,13.82 22.69,13.17 J2.5
DIO_23
  Top 0.2: U1.26 20.75,31 21.44,30.31 21.44,19.17 24.04,16.56 J2.6
DIO_24
  Top 0.2: U1.27 20.91,32.51 21.79,31.63 21.79,20.5 J2.7
DIO_25
  Top 0.2: U1.28 21.8,34.45 22.14,34.11 22.14,23.54 24.04,21.64 J2.8
DIO_26
  Top 0.2: U1.29 21.84,35.55 22.49,34.89 22.49,25.73 24.04,24.18 J2.9
DIO_27  (via drill 0.3)
  Top 0.2: U1.30 20.87,36.61 v19.51,36.61
  Bottom 0.2: v19.51,36.61 20.11,36.61 22.49,34.23 22.49,28.27 24.04,26.72 J2.10
DIO_28  (via drill 0.3)
  Top 0.2: U1.31 20.87,37.71 v19.51,37.71
  Bottom 0.2: v19.51,37.71 22.85,34.37 22.85,30.46 24.04,29.26 J2.11
DIO_29
  Top 0.2: U1.32 21.8,38.85 22.14,38.51 22.14,35.74 22.85,35.04 22.85,32.14 J2.12
DIO_30
  Top 0.2: U1.33 21.95,39.95 22.49,39.41 22.49,35.89 24.04,34.34 J2.13
DTR
  Top 0.2: U$3.4 4.66,12.16 5.31,12.81 U$3.2
EN
  Top 0.2: U2.3 19.36,20.56 19.11,20.81 16.31,20.81 16.01,20.51 R2.1
GND  (via drill 0.3)
  Top 0.2: U1.39 22.05,46.55 v22.61,47.11 | v15.21,32.41 14.94,32.14 U1.22 | BTN1.1 BTN1.2 | J5.B1A12 16.61,8.1 16.83,7.89 J5.S2 | J5.A1B12 8.5,8.1 8.11,7.71 8.11,7.27 J5.S1 | C1.2 18.61,17.91 18.41,18.11 U2.2
  Top 0.406: J5.A1B12
  Bottom 0.2: Y2.2 18.43,41.98 17.28,40.83 Y2.4 16.26,40.01 v16.21,40.01
  other vias: 20.91,50.51 24.71,50.11 5.61,49.61 6.41,48.81 7.21,49.61 8.81,49.61 10.41,49.61 12.01,49.61 13.61,49.61 15.21,49.61 16.81,49.61 18.41,49.61 20.01,49.61 8.01,48.81 9.61,48.81 11.21,48.81 12.91,48.81 14.41,48.81 16.11,48.71 17.71,48.71 19.31,48.71 2.31,44.91 6.31,50.51 8.11,50.51 9.61,50.51 11.21,50.51 12.81,50.51 14.41,50.51 16.01,50.51 17.61,50.51 19.31,50.51 4.81,50.51 0.81,50.51 4.71,48.81 20.91,48.81 22.91,11.91 23.41,1.21 22.91,14.41 19.91,20.91 5.51,7.61 21.01,8.61 22.21,3.71 2.11,1.41 3.41,9.31 6.11,39.61 5.71,26.91 8.51,28.01 10.71,4.01 15.01,3.91 5.51,8.81 9.21,5.71 6.61,7.11 18.51,22.21 4.91,10.51 22.71,45.01 5.11,3.01 20.01,2.91 21.61,6.71 9.01,19.71 11.41,20.21 14.91,20.41 5.61,20.91 10.31,17.31 11.01,6.61 19.51,45.41 13.51,45.11 15.61,45.11 17.61,45.11 11.41,39.51 13.71,38.21 11.11,37.51 12.31,36.11 14.41,40.51 15.81,38.71 9.21,41.01 13.21,42.81 8.81,37.01 16.91,14.41 23.21,37.31 23.11,39.91 19.51,34.41 17.71,36.71 13.71,27.11 15.21,22.71 19.91,29.31 13.01,23.31
  pour Top: -0.2,51.11 -0.2,-0.49 25.71,-0.49 25.71,51.11
  pour Bottom: -0.4,51.11 -0.4,-0.29 25.51,-0.29 25.51,51.11
LDO  (via drill 0.3)
  Top 0.2: D5.A 21.28,15.41 R11.2 | U3.10 11.41,13.31 11.71,13.61 11.71,14.61 11.51,14.81 U3.7 9.11,14.81 v8.91,15.01
  Top 0.254: C4.2 7.71,12.81 v7.81,12.91
  Top 0.406: U2.5 17.46,23.56 C2.1 17.61,23.71 v17.61,25.01 | D5.A 20.16,14.96 19.96,14.76 Q3.1
  Top 0.508: D5.A 19.21,15.41 18.81,15.81 v18.81,16.01
  Bottom 0.305: v18.81,16.01 18.81,11.01 16.75,8.95 9.97,8.95 8.91,10.01 8.91,12.91 | 8.91,12.91 v8.91,15.01 | v7.81,12.91 8.91,12.91
  Bottom 0.508: v17.61,25.01 17.61,17.21 v18.81,16.01
N$1  (via drill 0.3)
  Top 0.2: U1.35 20.86,42.1 v19.63,42.1
  Bottom 0.2: 17.14,42.04 Y2.1 | Y2.1 17.91,42.81 18.97,42.81 19.63,42.15 v19.63,42.1 | C20.1 16.14,42.93 Y2.1
N$2
  Top 0.2: D1.C 1.53,51.39 1.91,51.01 1.91,50.54 R3.2
N$3
  Top 0.2: D2.C 23.99,51.39 23.61,51.01 23.61,50.54 R5.2
N$4  (via drill 0.3)
  Top 0.2: U1.34 v19.65,41.04
  Bottom 0.2: v19.65,41.04 19.45,40.83 Y2.3 18.55,40.83 19.48,39.91 C22.2
RESET  (via drill 0.3)
  Top 0.2: J2.19 23.03,47.72 20.64,47.72 18.9,45.98 18.9,34.8 18.24,34.14 U1.25 18.24,30.04 v17.91,29.71 | v7.01,13.31 5.96,12.26 U$3.6 5.96,10.66 4.56,9.26 4.56,6.26 5.06,5.76 6.71,5.76 7.52,4.96 RST.3 RST.4
  Bottom 0.2: v7.01,13.31 7.21,13.51 7.21,23.61 7.81,24.21 10.51,24.21 11.21,24.91 11.21,28.51 11.8,29.1 14.56,29.1 15.67,30.21 17.41,30.21 v17.91,29.71
RTS  (via drill 0.3)
  Top 0.2: U$3.5 5.31,12.21 5.96,12.86 U$3.1 5.96,13.61 5.96,14.46 v6.01,14.51 6.81,14.51 7.72,13.6 8.71,13.6 9.41,12.91 11.91,12.91 12.31,13.31 12.31,14.21 12.91,14.81 U3.4
TCK  (via drill 0.3)
  Top 0.2: J1.5 2.75,14.71 2.75,27.27 4.99,29.51 6.71,29.51 7.24,30.04 U1.15 7.24,33.04 7.91,33.71 v8.61,33.71 | J3.4 7.94,25.68 v8.01,25.61
  Bottom 0.2: v8.01,25.61 7.36,26.26 7.21,26.41 7.06,26.56 7.06,30.76 8.61,32.31 v8.61,33.71
TDI  (via drill 0.3)
  Top 0.2: J1.3 1.11,8.19 1.11,8.84 2.4,10.14 2.4,12.1 3.46,13.16 3.46,26.91 5.36,28.8 7,28.8 7.75,29.56 8.26,29.56 8.61,29.91 9.21,29.91 9.44,30.14 U1.17 9.44,32.84 v10.51,33.91 | J3.8 10.48,25.64 v10.51,25.61
  Bottom 0.2: v10.51,25.61 10.51,28.71 9.81,29.41 9.81,33.21 v10.51,33.91
TDO  (via drill 0.3)
  Top 0.2: J1.4 1.21,11.41 3.11,13.31 3.11,27.13 5.14,29.16 6.86,29.16 7.61,29.91 8.11,29.91 8.34,30.14 U1.16 8.34,32.34 9.71,33.71 v9.71,34.31 | J3.6 v9.21,25.61
  Bottom 0.2: v9.21,25.61 10.16,26.56 10.16,28.56 9.46,29.26 9.46,33.36 9.71,33.61 v9.71,34.31
TMS  (via drill 0.3)
  Top 0.2: J1.6 1.6,15.71 2.4,16.51 2.4,27.42 4.85,29.86 6.01,29.86 6.14,29.99 U1.14 6.14,32.44 v8.91,35.21 | J3.2 6.67,25.65 v6.71,25.61
  Bottom 0.2: v8.91,35.21 7.92,34.22 7.92,32.23 6.71,31.02 v6.71,25.61
VCC  (via drill 0.3)
  Top 0.2: J3.1 6.67,23.25 6.12,23.8 4.86,23.8 4.85,23.81 3.84,23.81
  Top 0.254: J1.2 1.21,6.37 2.43,7.58 2.43,9.33 2.78,9.68 2.78,11.95 3.84,13 3.84,23.81 3.84,26.75 5.51,28.43 7.16,28.43 7.91,29.18 8.41,29.18 8.77,29.53 14.29,29.53 14.81,29.01 v16.11,29.01
  Top 0.406: Q3.2 18.01,13.66 18.01,14.51 17.66,14.86 D5.C | U1.23 16.04,29.08 v16.11,29.01
  Top 0.508: U1.23 16.04,34.98 v16.01,35.01 | D5.C 17.61,15.46 17.61,16.01 17.46,16.16 | 17.46,16.16 v17.31,16.31 | C13.1 13.21,18.41 13.21,16.61 13.66,16.16 17.46,16.16
  Bottom 0.254: v16.01,35.01 16.61,35.61 16.61,37.51 17.51,38.41 20.13,38.41 20.93,39.21 20.93,43.59 20.43,44.09 9.73,44.09 9.41,44.41 I2C.2
  Bottom 0.508: v17.31,16.31 16.77,16.85 16.77,28.35 v16.11,29.01

### Text on the board
tNames: R | G | GND | RST | 0 | SC4 | 1 | SD5 | 6 | RX2 | 7 | TX3 | 8 | GND | 12 | JLCJLCJLCJLC | 30 | 13 | 29 | 14 | JTAG | 28 | 9 | 27 | 10 | 26 | . | 11 | 25 | 15 | 24 | TMS | 23 | 22 | TCK | TDO | 21 | TDI | 20 | 3V3 | 19 | GND | 18
bNames: t.me/deaxx